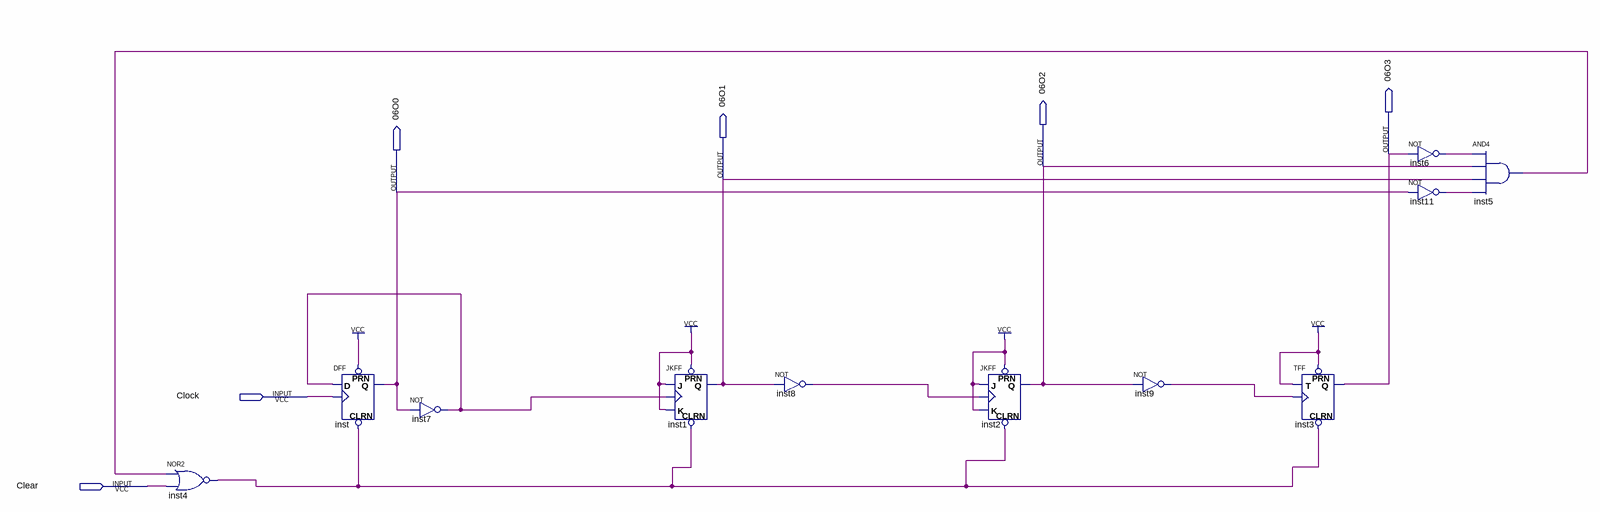
[diagram p0: schematic sheet]
// Quartus schematic Contador06.bdf as structural Verilog: 11 symbols, 6 pins
module Contador06 (
  input  Clock,
  input  Clear,
  output \06O3 ,
  output \06O2 ,
  output \06O1 ,
  output \06O0 
);

  wire inst4_out, inst5_out, inst6_out, inst7_out, inst8_out, inst9_out, inst11_out;

  nor inst4 (inst4_out, inst5_out, Clear);
  DFF inst (.CLRN(inst4_out), .CLK(Clock), .D(inst7_out), .PRN(1'b1), .Q(\06O0 ));
  not inst7 (inst7_out, \06O0 );
  JKFF inst1 (.PRN(1'b1), .CLRN(inst4_out), .K(1'b1), .J(1'b1), .CLK(inst7_out), .Q(\06O1 ));
  not inst8 (inst8_out, \06O1 );
  JKFF inst2 (.PRN(1'b1), .CLRN(inst4_out), .K(1'b1), .J(1'b1), .CLK(inst8_out), .Q(\06O2 ));
  not inst9 (inst9_out, \06O2 );
  TFF inst3 (.PRN(1'b1), .CLRN(inst4_out), .T(1'b1), .CLK(inst9_out), .Q(\06O3 ));
  not inst6 (inst6_out, \06O3 );
  not inst11 (inst11_out, \06O0 );
  and inst5 (inst5_out, inst6_out, \06O2 , \06O1 , inst11_out);
endmodule
